# Altium schematic sheet PSU.SchDoc
size A; SheetNumber: 5; SheetTotal: 5
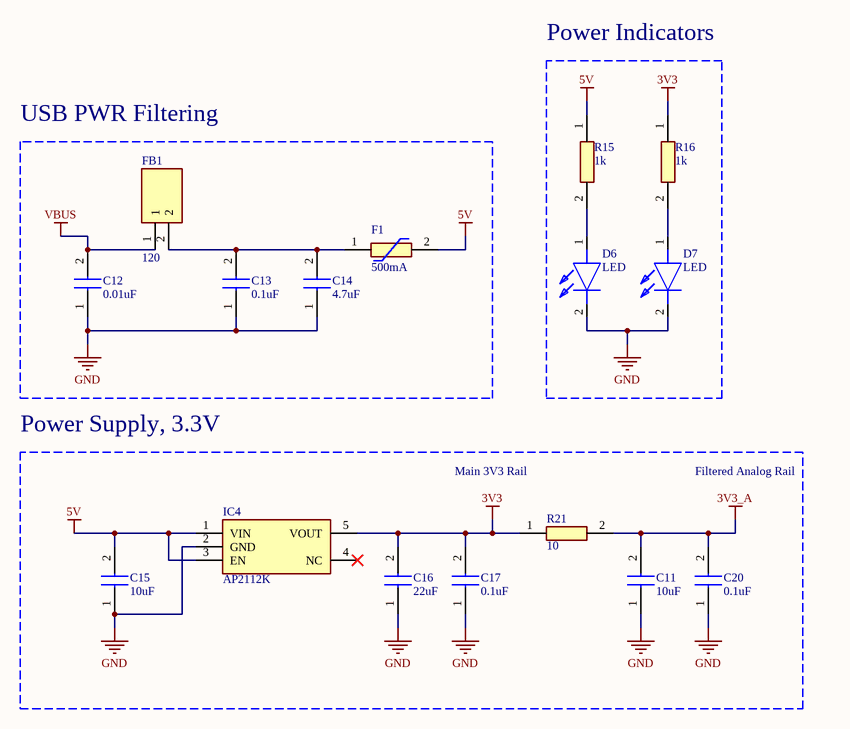
[diagram p0: PSU.SchDoc]

## Parts
C11  10uF  [CAPC2012X140N]
C12  0.01uF  [C0805]
C13  0.1uF  [CAPC2012X88N]
C14  4.7uF  [C0805]
C15  10uF  [CAPC2012X140N]
C16  22uF  [C0805]
C17  0.1uF  [CAPC2012X88N]
C20  0.1uF  [CAPC2012X88N]
D6  LED  [APT2012SECKJ3PRV]
D7  LED  [APT2012SECKJ3PRV]
F1  500mA  [1206L05015YR]
FB1  120  [BLM21AG102BH1J]
IC4  AP2112K  [SOT95P285X140-5N]
R15  1k  [RESC2012X60N]
R16  1k  [RESC2012X60N]
R21  10  [RESC2012X50N]

## Blocks framed on the sheet
Power Indicators: D6 D7 R15 R16
USB PWR Filtering: C12-C14 F1 FB1
Power Supply, 3.3V: C11 C15-C17 C20 IC4 R21

## Nets
3V3: C16.2 C17.2 IC4.5(VOUT) R16.1 R21.1
3V3_A: C11.2 C20.2 R21.2
5V: C15.2 F1.2 IC4.1(VIN) IC4.3(EN) R15.1
GND: C11.1 C12.1 C13.1 C14.1 C15.1 C16.1 C17.1 C20.1 D6.2(K) D7.2(K) IC4.2(GND)
VBUS: C12.2 FB1.1
NetC13_2: C13.2 C14.2 F1.1 FB1.2
NetD6_1: D6.1(A) R15.2
NetD7_1: D7.1(A) R16.2

Not connected (* = marked no-connect by the designer): IC4 4(NC)*

## Notes on the sheet
- Main 3V3 Rail
- Filtered Analog Rail

## Library data of the parts
C11 C15 = 10uF Capacitor 0805: Capacitor; Manufacturer_Name: Yageo Group; Manufacturer_Part_Number: C0805C106K8PACTU-2.5; Datasheet Link: https://www.kemet.com/specsheet/C0805C106K8PACTU; Height: 1.4mm; Mouser Part Number: N/A; Mouser Price/Stock: https://www.mouser.com/Search/Refine.aspx?Keyword=N%2FA
C12 = 0.01uF Capacitor 0805: Capacitor; Manufacturer_Name: Yageo Group; Manufacturer_Part_Number: C0805C103K1RECTU; Datasheet Link: https://www.yageogroup.com/content/datasheet/asset/file/KEM_C1090_X7R_ESD; Height: 1.1mm
C13 C17 C20 = 0.1uF Capacitor 0805: Capacitor; Manufacturer_Name: Yageo Group; Manufacturer_Part_Number: C0805C104K5RAC-TU; Datasheet Link: https://componentsearchengine.com/Datasheets/2/C0805C104K5RAC-TU.pdf; Height: 0.88mm; Arrow Part Number: C0805C104K5RAC-TU; Arrow Price/Stock: https://www.arrow.com/en/products/c0805c104k5ractu/kemet-corporation
C14 = 4.7uF Capacitor 0805: Capacitor; Manufacturer_Name: Yageo Group; Manufacturer_Part_Number: C0805X475M8RACTU; Datasheet Link: https://www.yageogroup.com/content/datasheet/asset/file/KEM_C1013_X7R_FT-CAP_SMD; Height: 1.1mm; Mouser Part Number: 80-C0805X475M8R; Mouser Price/Stock: https://www.mouser.com/Search/Refine.aspx?Keyword=80-C0805X475M8R; Arrow Part Number: C0805X475M8RACTU; Arrow Price/Stock: https://www.arrow.com/en/products/c0805x475m8ractu/kemet-corporation
C16 = 22uF Capacitor 0805: Capacitor; Manufacturer_Name: Yageo Group; Manufacturer_Part_Number: C0805C226M8PAC7210; Datasheet Link: https://www.yageogroup.com/content/datasheet/asset/file/KEM_C1006_X5R_SMD; Height: 1.1mm; Mouser Part Number: 80-C0805C226M8P7210; Mouser Price/Stock: https://www.mouser.co.uk/ProductDetail/KEMET/C0805C226M8PAC7210?qs=cGEy3R83DS8oofmRMj%2F42w%3D%3D
D6 D7 = Orange LED: Manufacturer_Name: Kingbright; Manufacturer_Part_Number: APT2012SECK/J3-PRV; Datasheet Link: https://www.mouser.ph/ProductDetail/Kingbright/APT2012SECK-J3-PRV?qs=D2TOvUWgdJ6T9J6WfI%252BQOg%3D%3D; Height: 0.85mm; Mouser Part Number: 604-APT2012SECKJ3PRV; Mouser Price/Stock: https://www.mouser.co.uk/ProductDetail/Kingbright/APT2012SECK-J3-PRV?qs=D2TOvUWgdJ6T9J6WfI%252BQOg%3D%3D; Arrow Part Number: APT2012SECK/J3-PRV; Arrow Price/Stock: https://www.arrow.com/en/products/apt2012seckj3-prv/kingbright?region=nac
F1 = 500mA Fuse: Resettable Fuse; Manufacturer_Name: LITTELFUSE; Manufacturer_Part_Number: 1206L050YR; Datasheet Link: https://m.littelfuse.com/~/media/electronics/datasheets/resettable_ptcs/littelfuse_ptc_1206l_datasheet.pdf.pdf; Height: 0.75mm; Mouser Part Number: 576-1206L050YR; Mouser Price/Stock: https://www.mouser.co.uk/ProductDetail/Littelfuse/1206L050YR?qs=PWhpLWeW8wckT8hV5jLiAA%3D%3D; Arrow Part Number: 1206L050YR; Arrow Price/Stock: https://www.arrow.com/en/products/1206l050yr/littelfuse.html?utm_currency=USD&region=europe
FB1 = 120 Ferrite Bead: Filter; Manufacturer_Name: Murata Electronics; Manufacturer_Part_Number: BLM21PG121SN1D; Datasheet Link: https://www.murata.com/en-us/products/productdetail?partno=BLM21PG121SN1%23; Height: 1.05mm; Mouser Part Number: 81-BLM21PG121SN1D; Mouser Price/Stock: https://www.mouser.co.uk/ProductDetail/Murata-Electronics/BLM21PG121SN1D?qs=MY6wChARw2zaR3kESBLGTQ%3D%3D; Arrow Part Number: BLM21PG121SN1D; Arrow Price/Stock: https://www.arrow.com/en/products/blm21pg121sn1d/murata-manufacturing?utm_currency=USD&region=europe
IC4 = LDO: Integrated Circuit; Manufacturer_Name: Diodes Incorporated; Manufacturer_Part_Number: AP2112K-3.3TRG1; Datasheet Link: https://www.diodes.com//assets/Datasheets/AP2112.pdf; Height: 1.4mm; Mouser Part Number: 621-AP2112K-3.3TRG1; Mouser Price/Stock: https://www.mouser.co.uk/ProductDetail/Diodes-Incorporated/AP2112K-3.3TRG1?qs=x6A8l6qLYDDPYHosCdzh%2FA%3D%3D; Arrow Part Number: AP2112K-3.3TRG1; Arrow Price/Stock: https://www.arrow.com/en/products/ap2112k-3-3trg1_3/diodes-incorporated.html?utm_currency=USD&region=nac
R15 R16 = 1k Resistor: Resistor; Manufacturer_Name: Yageo Group; Manufacturer_Part_Number: RC0805FR-071KL; Datasheet Link: https://www.yageo.com/upload/media/product/productsearch/datasheet/rchip/PYu-RC_Group_51_RoHS_L_11.pdf; Height: 0.6mm; Mouser Part Number: 603-RC0805FR-071KL; Mouser Price/Stock: https://www.mouser.co.uk/ProductDetail/YAGEO/RC0805FR-071KL?qs=1ogmaHw32WJjeGY0DHXakQ%3D%3D; Arrow Part Number: RC0805FR-071KL; Arrow Price/Stock: https://www.arrow.com/en/products/rc0805fr-071kl/yageo?utm_currency=USD&region=europe
R21 = 10 Resistor 0805: Resistor; Manufacturer_Name: Vishay; Manufacturer_Part_Number: CRCW080510R0FKEA; Datasheet Link: http://www.vishay.com/docs/20035/dcrcwe3.pdf; Height: 0.5mm; Mouser Part Number: 71-CRCW0805-10-E3; Mouser Price/Stock: https://www.mouser.co.uk/ProductDetail/Vishay-Dale/CRCW080510R0FKEA?qs=LOX6nxTstiaUTSGGiXqphg%3D%3D; Arrow Part Number: CRCW080510R0FKEA; Arrow Price/Stock: https://www.arrow.com/en/products/crcw080510r0fkea/vishay